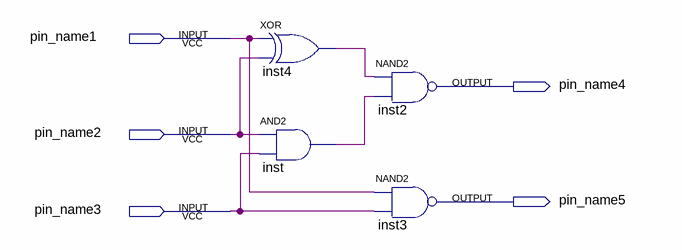
[diagram p0: schematic sheet]
// Quartus schematic Train_project.bdf as structural Verilog: 4 symbols, 5 pins
module Train_project (
  input  pin_name1,
  input  pin_name2,
  input  pin_name3,
  output pin_name4,
  output pin_name5
);

  wire inst4_out, inst_out;

  xor inst4 (inst4_out, pin_name1, pin_name2);
  and inst (inst_out, pin_name2, pin_name3);
  nand inst2 (pin_name4, inst4_out, inst_out);
  nand inst3 (pin_name5, pin_name1, pin_name3);
endmodule
